# EasyEDA Pro project 通用ARM32位处理器开发板.epro, board PCB2
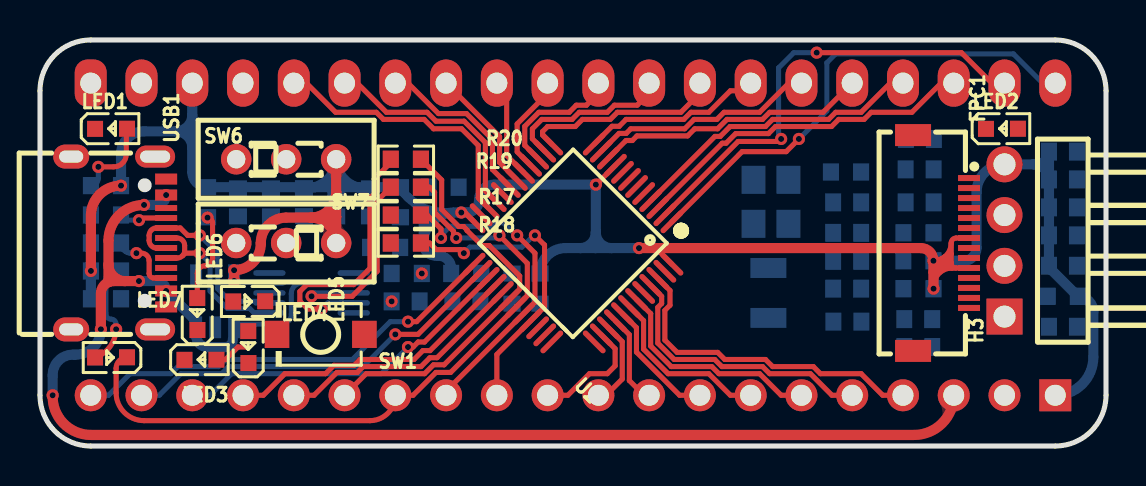
[diagram p3: board, top side]
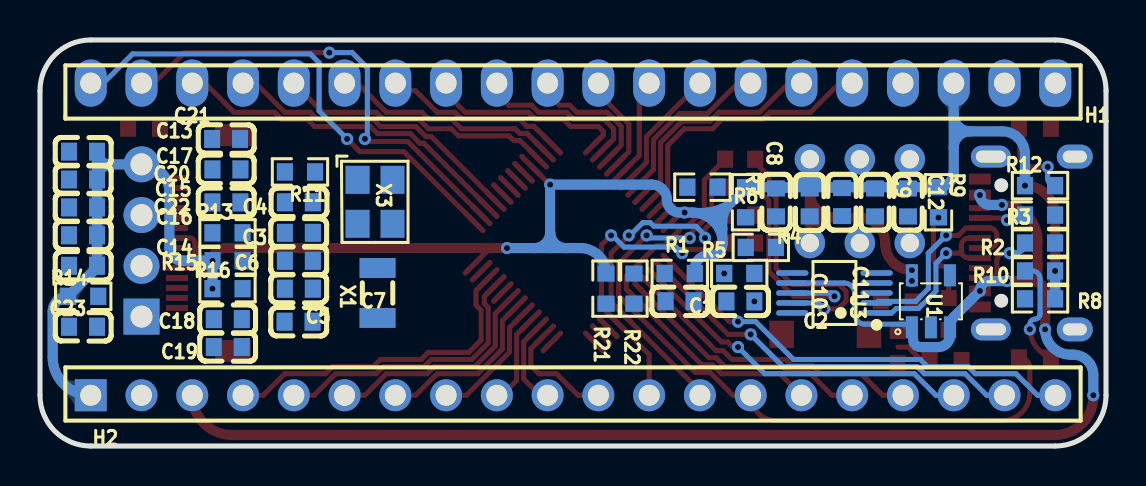
[diagram p4: board, bottom side, seen from below]

Outline 53.34 x 20.32 mm; copper layers: Top Layer, Bottom Layer. Coordinates in mm from the lower left corner of the outline.
Outline path: 0,17.78 0,2.54 arc(0.74,0.74) 2.54,0 50.8,0 arc(52.6,0.74) 53.34,2.54 53.34,17.78 arc(52.6,19.58) 50.8,20.32 2.54,20.32 arc(0.74,19.58) 0,17.78
Stack: Top Layer 0.035mm / Dielectric1 1.51mm FR4 er 4.5 / Bottom Layer 0.035mm

## Design rules (mm)
template: JLCPCB Capability(Two Layers Board)
spacing copperThickness1oz (default): track to track 0.102, other pairs 0.152 to 0.3
spacing copperThickness2oz: track to track 0.203, other pairs 0.152 to 0.3
track width copperThickness1oz (default): min 0.127, default 0.254, max 2.54
track width copperThickness2oz: min 0.203, default 0.254, max 2.54
differential pair differentialPair (default): width min 0.127, default 0.254, max 2.54; gap min 0.152, default 0.152
via viaSize (default): diameter min 0.5, default 0.61, max 10; hole min 0.3, default 0.305, max 6.3

## Placement (name value [footprint] x y rotation side)
C1  100nF  [C0603]  21.34 7.24 0 bottom
C2  100nF  [C0603]  18.3 7.24 0 bottom
C3  20pF  [C0603]  40.39 10.67 180 bottom
C4  20pF  [C0603]  40.39 12.19 0 bottom
C5  20pF  [C0603]  40.39 7.87 180 bottom
C6  20pF  [C0603]  40.39 9.27 180 bottom
C7  2.2uF  [C0603]  40.4 6.22 0 bottom
C8  2.2uF  [C0603]  16.51 12.19 270 bottom
C9  1uF  [C0603]  11.56 12.19 270 bottom
C10  1uF  [C0603]  14.82 12.19 90 bottom
C11  100nF  [C0603]  13.21 12.21 90 bottom
C12  100nF  [C0603]  9.91 12.19 270 bottom
C13  100nF  [C0603]  51.18 14.73 0 bottom
C14  100nF  [C0603]  51.18 9.02 0 bottom
C15  100nF  [C0603]  51.18 11.94 0 bottom
C16  100nF  [C0603]  51.18 10.55 0 bottom
C17  100nF  [C0603]  51.18 13.34 0 bottom
C18  1uF  [C0603]  43.94 6.35 180 bottom
C19  1uF  [C0603]  43.94 4.95 180 bottom
C20  4.7uF  [C0603]  44.01 13.84 180 bottom
C21  100nF  [C0603]  44.03 15.37 0 bottom
C22  2.2uF  [C0603]  44.01 12.19 180 bottom
C23  4.7uF  [C0603]  51.18 5.97 0 bottom
FPC1  FPC-05F-14PH15  [FPC-SMD_14P-P0.50_XUNPU_FPC-05F-14PH15]  45.09 10.16 270 top
H1  X6511WV-20H-C60D30  [hdr-th_20p-p2.54-v-m]  26.67 17.78 0 bottom
H2  X6511WV-20H-C60D30  [HDR-TH_20P-P2.54-V-M]  26.67 2.54 180 bottom
H3  PZ254R-11-04P  [HDR-TH_4P-P2.54-H-M-W10.4]  48.26 10.29 90 top
LED1  XL-1608SURC-06  [LED0603-RD_RED]  3.56 15.88 0 top
LED2  XL-1608SURC-06  [LED0603-RD_RED]  48.13 15.88 0 top
LED3  XL-1608SURC-06  [LED0603-RD_RED]  8.03 4.32 0 top
LED4  XL-1608SURC-06  [LED0603-RD_RED]  10.47 7.24 180 top
LED5  XL-1608SURC-06  [LED0603-RD_RED]  10.43 4.95 90 top
LED6  XL-1608SURC-06  [LED0603-RD_RED]  7.87 6.61 90 top
LED7  XL-1608SURC-06  [LED0603-RD_RED]  3.56 4.43 180 top
R1  10kΩ  [R0603]  21.33 8.64 180 bottom
R2  5.1kΩ  [R0603]  3.3 10.16 180 bottom
R3  5.1kΩ  [R0603]  3.3 11.56 180 bottom
R4  510Ω  [R0603]  18.35 8.64 180 bottom
R5  10kΩ  [R0603]  17.27 9.94 180 bottom
R6  10kΩ  [R0603]  20.19 12.95 0 bottom
R7  10kΩ  [R0603]  18.03 12.2 90 bottom
R8  10kΩ  [R0603]  3.3 7.37 180 bottom
R9  10kΩ  [R0603]  8.38 12.2 90 bottom
R10  10kΩ  [R0603]  3.3 8.76 180 bottom
R11  10kΩ  [R0603]  40.33 13.72 180 bottom
R12  10kΩ  [R0603]  3.3 13.03 0 bottom
R13  560kΩ  [R0603]  43.96 10.67 0 bottom
R14  4.7kΩ  [R0603]  51.18 7.49 0 bottom
R15  4.7kΩ  [R0603]  43.95 9.27 180 bottom
R16  4.7kΩ  [R0603]  43.96 7.87 0 bottom
R17  0Ω  [R0603]  18.31 11.56 180 top
R18  0Ω  [R0603]  18.31 10.16 180 top
R19  0Ω  [R0603]  18.31 12.95 180 top
R20  0Ω  [R0603]  18.31 14.35 180 top
R21  0Ω  [R0603]  25.02 7.88 270 bottom
R22  0Ω  [R0603]  23.62 7.88 270 bottom
SW1  TS-1088R-02026  [SW-SMD_L3.9-W3.0-P4.45]  14.05 5.59 180 top
SW6  SS-12D01-G040  [SW-TH_SS-12D01-GX]  12.32 14.35 0 top
SW7  SS-12D01-G040  [SW-TH_SS-12D01-GX]  12.32 10.16 180 top
U1  SE5218ALG-LF  [SOT-23-5_L3.0-W1.7-P0.95-LS2.8-BR]  8.76 7.24 270 bottom
U2  STM32F103C8T6  [LQFP-48_L7.0-W7.0-P0.50-LS9.0-BL]  26.67 10.16 135 top
U3  CH340E  [MSOP-10_L3.0-W3.0-P0.50-LS5.0-BL]  13.59 7.66 90 bottom
USB1  TYPE-C 16PIN 2MD(073)  [USB-C-SMD_TYPE-C-6PIN-2MD-073]  3.94 10.16 270 top
X1  32.768kHz  [fc-135r_l3.2-w1.5]  36.45 7.66 270 bottom
X3  8MHz  [OSC-SMD_4P-L3.2-W2.5-BL]  36.58 12.22 270 bottom

## Footprints (pads in the part's own frame, mm; a bottom-side part is the same pattern mirrored in y, then rotated)
C0603
  rect 0.8x0.9 smd: 1(-0.7,0) 2(0.7,0)
fc-135r_l3.2-w1.5
  rect 1x1.8 smd: 1(-1.25,0) 2(1.25,0)
FPC-SMD_14P-P0.50_XUNPU_FPC-05F-14PH15
  rect 0.3x1.1 smd: 1(-3.25,1.4) 2(-2.75,1.4) 3(-2.25,1.4) 4(-1.75,1.4) 5(-1.25,1.4) 6(-0.75,1.4) 7(-0.25,1.4) 8(0.25,1.4) 9(0.75,1.4) 10(1.25,1.4) 11(1.75,1.4) 12(2.25,1.4) 13(2.75,1.4) 14(3.25,1.4)
  rect 1.1x1.8 smd: 15(5.4,-1.4) 16(-5.4,-1.4)
HDR-TH_4P-P2.54-H-M-W10.4
  rect 1.8x1.8 hole 1.1: 1(-3.81,0)
  round 1.8 hole 1.1: 2(-1.27,0) 3(1.27,0) 4(3.81,0)
HDR-TH_20P-P2.54-V-M
  rect 1.6x1.6 hole 1.05: 1(-24.13,0)
  round 1.6 hole 1.05: 2(-21.59,0) 3(-19.05,0) 4(-16.51,0) 5(-13.97,0) 6(-11.43,0) 7(-8.89,0) 8(-6.35,0) 9(-3.81,0) 10(-1.27,0) 11(1.27,0) 12(3.81,0) 13(6.35,0) 14(8.89,0) 15(11.43,0) 16(13.97,0) 17(16.51,0) 18(19.05,0) 19(21.59,0) 20(24.13,0)
hdr-th_20p-p2.54-v-m
  rrect 1.6x2.362 hole 1.05: 1(-24.13,-0.381)
  oval 1.6x2.362 hole 1.05: 2(-21.59,-0.381) 3(-19.05,-0.381) 4(-16.51,-0.381) 5(-13.97,-0.381) 6(-11.43,-0.381) 7(-8.89,-0.381) 8(-6.35,-0.381) 9(-3.81,-0.381) 10(-1.27,-0.381) 11(1.27,-0.381) 12(3.81,-0.381) 13(6.35,-0.381) 14(8.89,-0.381) 15(11.43,-0.381) 16(13.97,-0.381) 17(16.51,-0.381) 18(19.05,-0.381) 19(21.59,-0.381) 20(24.13,-0.381)
LED0603-RD_RED
  rect 0.8x0.8 smd: 1(-0.799,-0.004) 2(0.799,0.004)
LQFP-48_L7.0-W7.0-P0.50-LS9.0-BL
  oval 0.27x1.5 smd: 1(-2.75,-4.25) 2(-2.25,-4.25) 3(-1.75,-4.25) 4(-1.25,-4.25) 5(-0.75,-4.25) 6(-0.25,-4.25) 7(0.25,-4.25) 8(0.75,-4.25) 9(1.25,-4.25) 10(1.75,-4.25) 11(2.25,-4.25) 12(2.75,-4.25) 25(2.75,4.25) 26(2.25,4.25) 27(1.75,4.25) 28(1.25,4.25) 29(0.75,4.25) 30(0.25,4.25) 31(-0.25,4.25) 32(-0.75,4.25) 33(-1.25,4.25) 34(-1.75,4.25) 35(-2.25,4.25) 36(-2.75,4.25)
  oval 1.5x0.27 smd: 13(4.25,-2.75) 14(4.25,-2.25) 15(4.25,-1.75) 16(4.25,-1.25) 17(4.25,-0.75) 18(4.25,-0.25) 19(4.25,0.25) 20(4.25,0.75) 21(4.25,1.25) 22(4.25,1.75) 23(4.25,2.25) 24(4.25,2.75) 37(-4.25,2.75) 38(-4.25,2.25) 39(-4.25,1.75) 40(-4.25,1.25) 41(-4.25,0.75) 42(-4.25,0.25) 43(-4.25,-0.25) 44(-4.25,-0.75) 45(-4.25,-1.25) 46(-4.25,-1.75) 47(-4.25,-2.25) 48(-4.25,-2.75)
MSOP-10_L3.0-W3.0-P0.50-LS5.0-BL
  oval 0.28x1.62 smd: 1(-1,-2.11) 2(-0.5,-2.11) 3(0,-2.11) 4(0.5,-2.11) 5(1,-2.11) 6(1,2.11) 7(0.5,2.11) 8(0,2.11) 9(-0.5,2.11) 10(-1,2.11)
OSC-SMD_4P-L3.2-W2.5-BL
  rect 1.4x1.2 smd: 1(-1.1,-0.875) 2(1.1,-0.875) 3(1.1,0.875) 4(-1.1,0.875)
R0603
  rect 0.806x0.864 smd: 1(-0.753,0) 2(0.753,0)
SOT-23-5_L3.0-W1.7-P0.95-LS2.8-BR
  rect 1.1x0.6 smd: 1(1.3,-0.95) 2(1.3,0) 3(1.3,0.95) 4(-1.3,0.95) 5(-1.3,-0.95)
SW-SMD_L3.9-W3.0-P4.45
  rect 1.23x1.36 smd: 1(-2.185,0) 2(2.185,0)
SW-TH_SS-12D01-GX
  round 1.524 hole 0.914: 1(-2.5,0) 2(0,0) 3(2.5,0)
USB-C-SMD_TYPE-C-6PIN-2MD-073
  rect 0.55x1.1 smd: 1(-3.2,2.375) 2(-2.4,2.375) 11(2.4,2.375) 12(3.2,2.375)
  rect 0.3x1.1 smd: 3(-1.75,2.375) 4(-1.25,2.375) 5(-0.75,2.375) 6(-0.25,2.375) 7(0.25,2.375) 8(0.75,2.375) 9(1.25,2.375) 10(1.75,2.375)
  oval 1.1x2 hole 0.6x1.5: 13(-4.325,1.825) 14(4.325,1.825)
  oval 1.2x1.8 hole 0.6x1.2: 13(-4.325,-2.375) 14(4.325,-2.375)

## Nets
+5V: C7.2 H2.3 U1.1 U1.3 U3.7 USB1.2 USB1.11
GND: C1.1 C2.2 C3.1 C4.1 C5.1 C6.1 C7.1 C8.2 C9.2 C10.1 C11.1 C12.2 C13.2 C14.2 C15.2 C16.2 C17.2 C20.2 C21.1 C22.1 C23.1 FPC1.8 FPC1.15 FPC1.16 H1.1 H1.2 H2.2 H3.1 LED1.1 LED2.1 LED3.1 R2.2 R3.2 R13.2 R22.1 SW1.1 SW6.1 SW7.3 U1.2 U2.8 U2.23 U2.47 U3.3 USB1.1 USB1.12 USB1.13 USB1.14 X3.2 X3.4
VBAT: H1.20 U2.1
VCC: C8.1 C9.1 C10.2 C11.2 C12.1 C13.1 C14.1 C15.1 C16.1 C17.1 FPC1.7 FPC1.10 H1.3 H2.1 H3.4 R1.2 R7.2 R8.2 R9.2 R10.2 R12.2 R14.2 R15.1 R16.2 R21.1 SW6.3 SW7.1 U1.5 U2.9 U2.24 U2.48
BOOT0: R5.1 U2.44
C1N: C18.2 FPC1.11
C1P: C18.1 FPC1.12
C2N: C19.1 FPC1.13
C2P: C19.2 FPC1.14
NRST: C1.2 H1.4 R1.1 SW1.2 U2.7
OSC32_IN: C5.2 X1.2
OSC32_OUT: C6.2 X1.1
OSC_IN: C3.2 U2.5 X3.3
OSC_OUT: C4.2 U2.6 X3.1
PA0: H1.16 U2.10
PA1: H1.15 U2.11
PA2: H1.14 U2.12
PA3: H1.13 U2.13
PA4: H1.12 U2.14
PA5: H1.11 U2.15
PA6: H1.10 U2.16
PA7: H1.9 U2.17
PA8: H2.16 U2.29
PA9/USART0_TX: H2.15 LED6.1 R20.1 U2.30
PA10/USART0_RX: H2.14 LED7.1 R19.1 U2.31
PA11/USB_D-: H2.13 LED5.1 R17.1 U2.32
PA12/USB_D+: H2.12 LED4.1 R18.1 U2.33
PA13/SWDIO: H3.3 U2.34
PA14/SWCLK: H3.2 U2.37
PA15: H2.11 U2.38
PB0: H1.8 U2.18
PB1: H1.7 U2.19
PB2/BOOT1: R6.2 U2.20
PB3: H2.10 U2.39
PB4: H2.9 U2.40
PB5: H2.8 U2.41
PB6/SDA: FPC1.4 H2.7 R15.2 U2.42
PB7/SCL: FPC1.5 H2.6 R16.1 U2.43
PB8: H2.5 U2.45
PB9: H2.4 U2.46
PB10: H1.6 U2.21
PB11: H1.5 U2.22
PB12: H2.20 U2.25
PB13: H2.19 U2.26
PB14: H2.18 U2.27
PB15: H2.17 U2.28
PC13: H1.19 R11.2 U2.2
PC14/OSC32_IN: H1.18 U2.3
PC15/OSC32_OUT: H1.17 U2.4
RES#: C23.2 FPC1.6 R14.1
USART0_RX: R19.2 U3.8
USART0_TX: R20.2 U3.9
USB_D+: R18.2 U3.1 USB1.6 USB1.8
USB_D-: R17.2 U3.2 USB1.5 USB1.7
$1N2106: C2.1 U3.10
$1N2935: R3.1 USB1.4
$1N2938: R2.1 USB1.10
$1N3166: R4.2 U3.6
$1N3169: LED3.2 R4.1
$1N4228: R5.2 SW7.2
$1N4237: R6.1 SW6.2
$1N6427: LED4.2 R7.1
$1N6466: LED5.2 R8.1
$1N6674: LED6.2 R9.1
$1N6676: LED7.2 R10.1
$1N10384: LED1.2 R12.1
$1N10388: LED2.2 R11.1
$1N10989: C20.1 C21.2 FPC1.1
$1N10994: C22.2 FPC1.2
$1N11001: FPC1.3 R13.1
$1N13630: R21.2 U2.36
$1N13674: R22.2 U2.35

Pads without a net: FPC1 9; U1 4; U3 4 5; USB1 3 9

## Via types
v1: diameter 0.61, hole 0.305, Top Layer to Bottom Layer, 38 vias

## Routing (per net, layer and track width the routed paths; a pad name or vN(x,y) marks a point on that pad's centre or on a via; arc(x,y) is an arc through that point)
+5V: length 78.3
  Top Layer w0.508: 4.26,8.25 3.68,8.25 arc(3.57,8.24) 3.46,8.22 ; 4.26,8.25 v1(4.95,8.25) ; 4.26,8.25 arc(3.67,8.5) 3.43,9.08 ; 3.43,9.08 3.43,8.25 arc(3.44,8.23) 3.46,8.22 ; 3.43,9.08 3.43,10.29 arc(3.95,11.54) v1(5.21,12.06) ; v1(3.05,5.84) 3.05,7.62 arc(3.16,7.98) 3.46,8.22 ; v1(0.64,2.54) arc(1.17,1.14) 2.54,0.55 43.73,0.55 arc(45.14,1.14) H2.3
  Bottom Layer w0.254: U3.7 13.11,8.16 arc(12.73,8) 12.57,7.62 12.57,6.6 arc(12.42,6.24) 12.06,6.1 9.87,6.1 arc(9.76,6.05) U1.1
  Bottom Layer w0.508: v1(4.95,8.25) 5.82,8.25 arc(6.17,8.11) v1(6.31,7.76) 7.59,6.48 arc(7.75,6.23) U1.3 7.81,5.52 arc(7.98,5.12) 8.38,4.95 9.27,4.95 arc(9.54,5.06) 9.65,5.33 ; v1(0.64,2.54) 0.64,3.56 arc(0.93,4.27) 1.65,4.57 1.78,4.57 arc(2.68,4.94) v1(3.05,5.84) ; v1(5.21,12.06) 5.82,12.06 arc(6.17,12.21) v1(6.31,12.56)
VBAT: length 24.7
  Top Layer w0.254: U2.1 35.13,14.73 37.34,14.73 v1(37.97,15.37)
  Bottom Layer w0.254: H1.20 50.17,18.16 48.71,19.62 39.81,19.62 39.37,19.18 39.37,16.76 v1(37.97,15.37)
VCC: length 137.9
  Top Layer w0.254: 45.65,8.91 44.78,8.91 arc(44.77,8.92) 44.76,8.93 ; 45.65,8.91 45.83,8.91 ; 45.65,8.91 arc(44.98,8.64) 44.71,7.97 ; 45.65,8.91 arc(45.39,9.02) 45.29,9.27 ; FPC1.7 45.84,10.41 arc(45.67,10.34) 45.59,10.16 ; U2.24 21.26,11.68 v1(21.08,11.68) ; 45.59,9.62 45.57,9.59 arc(45.43,9.5) 45.26,9.47 ; 45.59,9.62 45.59,10.16 ; 45.59,9.62 45.59,9.14 ; 45.29,9.27 v1(44.7,9.27) arc(45,9.32) 45.26,9.47 ; 45.29,9.27 45.47,9.27 arc(45.56,9.23) 45.59,9.14 ; 45.29,9.27 arc(45.45,9.24) 45.59,9.14 ; FPC1.10 45.83,8.91 ; 45.83,8.91 arc(45.66,8.98) 45.59,9.14 ; 45.59,10.16 arc(45.51,9.78) 45.26,9.47 ; U2.48 30.81,9.91 ; 28.79,14.05 27.83,13.09 arc(27.82,13.08) v1(27.81,13.08)
  Top Layer w0.508: 13.55,11.43 14.8,11.43 arc(14.81,11.44) 14.82,11.45 ; 13.55,11.43 12.32,11.43 arc(11.42,11.06) 11.05,10.16 11.05,10.14 arc(10.66,9.19) v1(9.71,8.8) v1(9.71,8.26) ; 13.55,11.43 arc(14.45,11.8) 14.82,12.7 ; 13.55,11.43 arc(14.45,11.06) SW7.1 14.82,11.45 ; v1(2.55,8.76) 2.55,11.52 arc(2.99,12.59) v1(4.06,13.03) ; 44.71,8.69 v1(44.71,7.87) ; 44.71,8.69 44.71,9.27 arc(44.71,9.27) v1(44.7,9.27) arc(44.52,9.72) 44.07,9.91 v1(29.97,9.91) ; 44.71,8.69 arc(44.72,8.82) 44.76,8.93 arc(44.81,9.02) 44.88,9.1 arc(45.06,9.23) 45.29,9.27 ; 14.82,12.7 SW6.3 ; 14.82,12.7 14.82,11.45
  Bottom Layer w0.457: 20.7,11.68 20.25,11.68 arc(20.1,11.69) 19.94,11.7 arc(19.73,11.74) 19.52,11.79 arc(19.15,11.93) 18.79,12.13 ; 19.43,11.56 19.43,11.47 arc(19.37,11.14) 19.18,10.86 ; 19.18,10.86 19.18,11.21 arc(19.08,11.71) 18.79,12.13 ; 19.18,10.86 19.18,10.41 ; 18.79,12.13 arc(18.6,12.28) 18.41,12.45 18.12,12.74 arc(18.06,12.84) R7.2
  Bottom Layer w0.508: v1(21.08,11.68) 21.34,11.68 arc(21.79,11.87) 21.97,12.32 arc(22.19,12.86) 22.73,13.08 v1(27.81,13.08) 27.81,10.69 ; v1(21.08,11.68) 21.01,11.68 ; v1(21.08,11.68) arc(21.05,11.68) 21.01,11.68 ; C8.1 16.28,12.89 arc(16.07,12.91) 15.86,12.95 ; C17.1 C15.1 C16.1 C14.1 50.48,8.94 R14.2 arc(52.48,7.27) 52.71,6.72 52.71,4.44 arc(52.15,3.1) H2.1 ; C17.1 C13.1 arc(50.3,14.28) 49.85,14.1 49.73,14.1 ; C17.1 arc(50.26,13.87) 49.73,14.1 ; v1(4.06,13.03) 4.06,14.6 arc(4.39,15.41) 5.21,15.75 6.8,15.75 ; 21.01,11.68 20.7,11.68 arc(19.62,11.24) 19.18,10.16 arc(19.36,9.71) 19.81,9.53 19.94,9.53 arc(20.39,9.34) 20.57,8.89 R1.2 ; R8.2 v1(2.55,8.76) ; 13.74,12.95 14.82,12.95 ; 13.74,12.95 R9.2 arc(7.84,13.18) 7.62,13.72 7.62,14.93 ; 13.74,12.95 arc(13.56,12.92) 13.38,12.91 C11.2 ; 13.74,12.95 arc(14.52,13.47) SW6.3 ; 14.82,12.95 15.86,12.95 ; 14.82,12.95 14.82,14.22 ; 14.82,12.95 C10.2 ; 49.73,14.1 48.26,14.1 arc(47.27,13.69) 46.86,12.7 46.86,9.91 arc(46.68,9.46) 46.23,9.27 v1(44.7,9.27) arc(44.71,9.27) 44.71,9.27 v1(44.71,7.87) ; 27.03,9.91 26.29,9.91 arc(25.39,9.53) R21.1 ; 27.03,9.91 27.81,9.91 ; 27.03,9.91 arc(27.58,10.14) 27.81,10.69 ; 27.81,10.69 27.81,9.91 ; 27.81,10.69 arc(28.04,10.14) 28.6,9.91 ; 27.81,9.91 28.6,9.91 ; 7.62,16.56 H1.3 ; 7.62,16.56 7.62,14.93 ; 7.62,16.56 arc(7.38,15.99) 6.8,15.75 ; 15.86,12.95 R7.2 ; 15.86,12.95 arc(15.15,13.43) 14.82,14.22 ; 7.62,14.93 arc(7.38,15.51) 6.8,15.75 ; 14.82,14.22 14.82,14.34 arc(14.82,14.35) SW6.3 ; 14.82,14.22 arc(14.82,14.28) SW6.3 ; 28.6,9.91 v1(29.97,9.91)
PA0: length 13.8
  Top Layer w0.254: H1.16 39.18,16.7 36.51,16.7 36.15,16.34 34.37,16.34 33.9,15.88 32.76,15.88 32.41,15.52 29.87,15.52 29.64,15.29 29.32,15.29 U2.10
PA1: length 11.4
  Top Layer w0.254: U2.11 28.97,15.64 29.33,15.64 29.56,15.88 32.26,15.88 32.73,16.34 33.87,16.34 34.23,16.7 36.01,16.7 37.47,18.16 H1.15
PA2: length 9.1
  Top Layer w0.254: H1.14 35.17,17.78 34.54,17.78 33.47,16.7 32.57,16.7 32.22,16.34 29.32,16.34 28.98,16 28.62,16 U2.12
PA3: length 10
  Top Layer w0.254: U2.13 25.15,15.57 25.15,15.74 25.4,15.99 26.78,15.99 27.14,16.34 28.53,16.34 28.89,16.7 32.07,16.7 33.02,17.65 H1.13
PA4: length 8.5
  Top Layer w0.254: U2.14 24.64,15.37 24.64,15.88 25.11,16.34 26.63,16.34 26.98,16.7 28.39,16.7 28.74,17.06 29.88,17.06 30.48,17.65 H1.12
PA5: length 6.7
  Top Layer w0.254: U2.15 24.26,15.05 24.26,16 24.96,16.7 26.48,16.7 26.84,17.06 27.34,17.06 27.94,17.65 H1.11
PA6: length 5
  Top Layer w0.254: H1.10 25.4,17.64 23.88,16.12 23.88,14.72 24.55,14.05
PA7: length 5
  Top Layer w0.254: U2.17 23.35,14.54 23.35,17.67 H1.9
PA8: length 12.6
  Top Layer w0.254: 23.13,7.69 19.87,4.42 19.51,4.42 19.06,3.97 16.17,3.97 15.88,3.68 14.86,3.68 13.71,2.54 H2.16
PA9/USART0_TX: length 19.9
  Top Layer w0.254: H2.15 16.32,3.62 19.25,3.62 19.69,4.06 20.22,4.06 U2.30 24,7.85 24,8.51 22.48,10.03 22.12,10.03 21.37,10.78 21.37,10.81 21.2,10.98 20.96,10.98 20.1,11.84 20.1,13.31 R20.1
PA10/USART0_RX: length 35.6
  Top Layer w0.254: v1(20.83,10.41) 20.69,10.55 20.69,10.74 19.74,11.69 19.74,12.7 19.49,12.95 R19.1 ; v1(22.99,10.54) 24.38,9.14 24.38,7.52 U2.31 20.55,3.68 19.81,3.68 18.67,2.54 H2.14 arc(17.41,1.64) 16.51,1.27 5.21,1.27 arc(4.22,1.68) 3.81,2.67 3.81,3.89 arc(3.97,4.28) LED7.1
  Bottom Layer w0.254: v1(22.99,10.54) 22.86,10.41 v1(20.83,10.41)
PA11/USB_D-: length 16.4
  Top Layer w0.254: R17.1 19.38,11.56 20.07,10.87 v1(20.07,10.41) ; H2.13 20.32,2.75 U2.32 24.76,7.19 24.76,9.65 v1(23.88,10.54)
  Bottom Layer w0.254: v1(23.88,10.54) 23.81,10.54 23.18,11.18 22.8,11.18 22.62,11 20.52,11 20.07,10.54 v1(20.07,10.41)
PA12/USB_D+: length 15.5
  Top Layer w0.254: v1(21.21,9.65) 21.03,9.83 19.82,9.83 19.49,10.16 R18.1 ; v1(24.76,10.54) 25.25,10.06 25.25,6.97 22.86,4.58 H2.12
  Bottom Layer w0.254: v1(24.76,10.54) 24.7,10.54 24.12,9.96 21.51,9.96 v1(21.21,9.65)
PA15: length 5.8
  Top Layer w0.254: U2.38 28.78,4.87 28.78,4.01 28.38,3.62 27.49,3.62 26.41,2.54 H2.11
PB0: length 6.3
  Top Layer w0.254: U2.18 23,14.19 23,15.48 H1.8
PB1: length 8.7
  Top Layer w0.254: U2.19 22.64,13.84 22.64,15.34 21.34,16.64 19.94,16.64 18.41,18.16 H1.7
PB3: length 4.4
  Top Layer w0.254: H2.10 28.32,2.54 29.13,3.35 29.13,5.22 U2.39
PB4: length 4.6
  Top Layer w0.254: H2.9 30.23,2.54 29.49,3.28 29.49,5.57 28.79,6.27
PB5: length 6.3
  Top Layer w0.254: H2.8 32.01,2.54 29.85,4.7 29.85,5.92 U2.41
PB6/SDA: length 8.7
  Top Layer w0.254: H2.7 34.55,2.54 33.47,3.62 31.43,3.62 30.2,4.85 30.2,6.28 U2.42
PB7/SCL: length 11.2
  Top Layer w0.254: H2.6 37.09,2.54 36.01,3.62 33.97,3.62 33.61,3.97 31.59,3.97 30.56,5 30.56,6.63 U2.43
PB8: length 14
  Top Layer w0.254: H2.5 39.63,2.54 38.55,3.62 36.51,3.62 36.15,3.97 34.12,3.97 33.76,4.33 31.73,4.33 30.91,5.15 30.91,6.94 31.11,7.13 31.11,7.49 U2.45
PB9: length 16.5
  Top Layer w0.254: H2.4 42.17,2.54 41.09,3.62 39.05,3.62 38.69,3.97 36.66,3.97 36.3,4.33 34.26,4.33 33.91,4.69 31.88,4.69 31.27,5.3 31.27,6.79 31.52,7.04 31.52,7.78 U2.46
PB10: length 11.4
  Top Layer w0.254: U2.21 22.28,12.78 22.28,15.19 21.22,16.26 19.81,16.26 19.37,16.7 17.33,16.7 15.87,18.16 H1.6
PB11: length 13.8
  Top Layer w0.254: H1.5 13.33,18.16 14.79,16.7 16.83,16.7 17.19,16.34 19.22,16.34 19.69,15.88 21.1,15.88 21.93,15.04 21.93,12.43 U2.22
PB12: length 21.9
  Top Layer w0.254: v1(18.41,6.22) 18.84,6.22 U2.25
  Bottom Layer w0.254: v1(18.41,6.22) 17.53,6.22 15.63,4.33 9.29,4.33 8.94,3.97 6.9,3.97 6.55,3.62 4.51,3.62 3.43,2.54 H2.20
PB13: length 19.6
  Top Layer w0.254: U2.26 18.92,5.59 v1(17.78,5.59)
  Bottom Layer w0.254: v1(17.78,5.59) 16.17,3.98 9.44,3.97 9.09,3.62 7.05,3.62 5.97,2.54 H2.19
PB14: length 17.2
  Top Layer w0.254: v1(18.41,4.95) 18.67,4.95 18.92,5.21 19.24,5.21 U2.27
  Bottom Layer w0.254: v1(18.41,4.95) 17.08,3.62 9.59,3.62 8.51,2.54 H2.18
PB15: length 14.9
  Top Layer w0.254: H2.17 11.17,2.54 12.25,3.62 14.29,3.62 14.71,4.04 15.72,4.04 16.01,4.33 18.71,4.33 19.16,4.78 19.52,4.78 U2.28
PC13: length 23.2
  Top Layer w0.254: H1.19 47.63,18.16 46.1,19.69 v1(38.86,19.69) ; v1(37.08,15.37) 36.96,15.24 34.93,15.24 U2.2
  Bottom Layer w0.254: v1(37.08,15.37) 36.96,15.49 36.96,18.93 37.72,19.69 v1(38.86,19.69)
PC14/OSC32_IN: length 17.4
  Top Layer w0.254: U2.3 34.14,15.15 34.33,15.15 34.81,15.63 36.45,15.63 36.8,15.99 39.61,15.99 39.96,16.34 41.23,16.34 41.59,16.7 43.63,16.7 45.09,18.16 H1.18
PC15/OSC32_OUT: length 15.1
  Top Layer w0.254: H1.17 42.55,18.16 41.09,16.7 39.81,16.7 39.46,16.34 36.66,16.34 36.3,15.99 34.53,15.99 34.04,15.49 33.77,15.49 U2.4
USART0_RX: length 10.5
  Top Layer w0.254: R19.2 16.87,12.27 16.87,8.74 15.62,7.49 v1(13.59,7.49)
  Bottom Layer w0.254: U3.8 13.76,7.66 v1(13.59,7.49)
USART0_TX: length 13.3
  Top Layer w0.254: v1(14.1,6.86) 13.4,6.86 13,7.25 13,7.73 13.35,8.08 15.7,8.08 16.51,8.89 16.51,12.41 16.87,12.77 16.87,13.5 17.55,14.18 R20.2
  Bottom Layer w0.254: U3.9 14.4,7.16 v1(14.1,6.86)
USB_D+: length 9
  Top Layer w0.254: v1(8,9.65) 7.26,9.65 7.15,9.54 ; USB1.8 6.87,9.41 arc(7.03,9.45) 7.15,9.54 ; USB1.6 6.86,10.41 arc(7.13,10.3) 7.24,10.03 7.24,9.78 arc(7.22,9.65) 7.15,9.54
  Bottom Layer w0.254: 11.48,6.66 10.72,6.66 10.49,6.88 9.38,6.88 8.51,7.75 8.51,9.14 v1(8,9.65)
USB_D-: length 10.1
  Top Layer w0.254: USB1.7 5.84,9.91 arc(5.57,10.02) 5.46,10.29 5.46,10.54 arc(5.57,10.8) 5.83,10.91 USB1.5 7.02,10.91 7.38,10.55 arc(7.38,10.55) 7.39,10.54 v1(8,10.54)
  Bottom Layer w0.254: v1(8,10.54) 8.89,9.65 8.89,7.87 9.53,7.24 11.4,7.24 11.48,7.16
$1N2106:
  vias: v1(17.6,7.24)
$1N2935: length 2.5
  Top Layer w0.254: USB1.4 5.06,11.41 arc(4.98,11.38) v1(4.95,11.3)
  Bottom Layer w0.254: v1(4.95,11.3) 4.31,11.3 arc(4.13,11.38) R3.1
$1N2938: length 4.3
  Top Layer w0.254: USB1.10 5.69,8.41 arc(5.53,8.48) 5.46,8.64 5.46,9.27 arc(5.35,9.54) 5.08,9.65 v1(4.83,9.65)
  Bottom Layer w0.254: v1(4.83,9.65) 4.56,9.65 ; 4.56,9.65 arc(4.2,9.8) R2.1 arc(4.2,9.8) 4.56,9.65
$1N3169: length 1.8
  Top Layer w0.254: 10.41,4.95 9.91,4.95 9.27,4.32 8.83,4.32
  vias: v1(19.1,8.64)
$1N6674: length 4.6
  Top Layer w0.254: LED6.2 7.87,8.63 arc(7.98,8.9) 8.25,9.02 arc(8.52,9.13) 8.64,9.4 8.64,11.18 arc(8.56,11.36) v1(8.38,11.43)
$1N6676: length 5.7
  Top Layer w0.254: LED7.2 2.78,4.43 arc(3.51,4.98) v1(3.81,5.84)
  Bottom Layer w0.254: R10.1 3.68,8.76 arc(3.41,8.65) 3.3,8.38 3.3,6.6 arc(3.38,6.42) 3.56,6.35 arc(3.74,6.28) 3.81,6.1 v1(3.81,5.84)
$1N10384: length 4.2
  Top Layer w0.254: v1(2.92,13.97) 3.68,13.97 arc(4.13,14.16) 4.32,14.61 4.32,15.84 arc(4.33,15.87) LED1.2
  Bottom Layer w0.254: v1(2.92,13.97) 2.92,13.4 arc(2.81,13.14) R12.1

Small or netless copper shapes (teardrops, artwork), in the pictures only: 14 on Top Layer, 24 on Bottom Layer
